# Altium schematic sheet OZ440-SE100-CAR003_sheet7.SchDoc
size A3
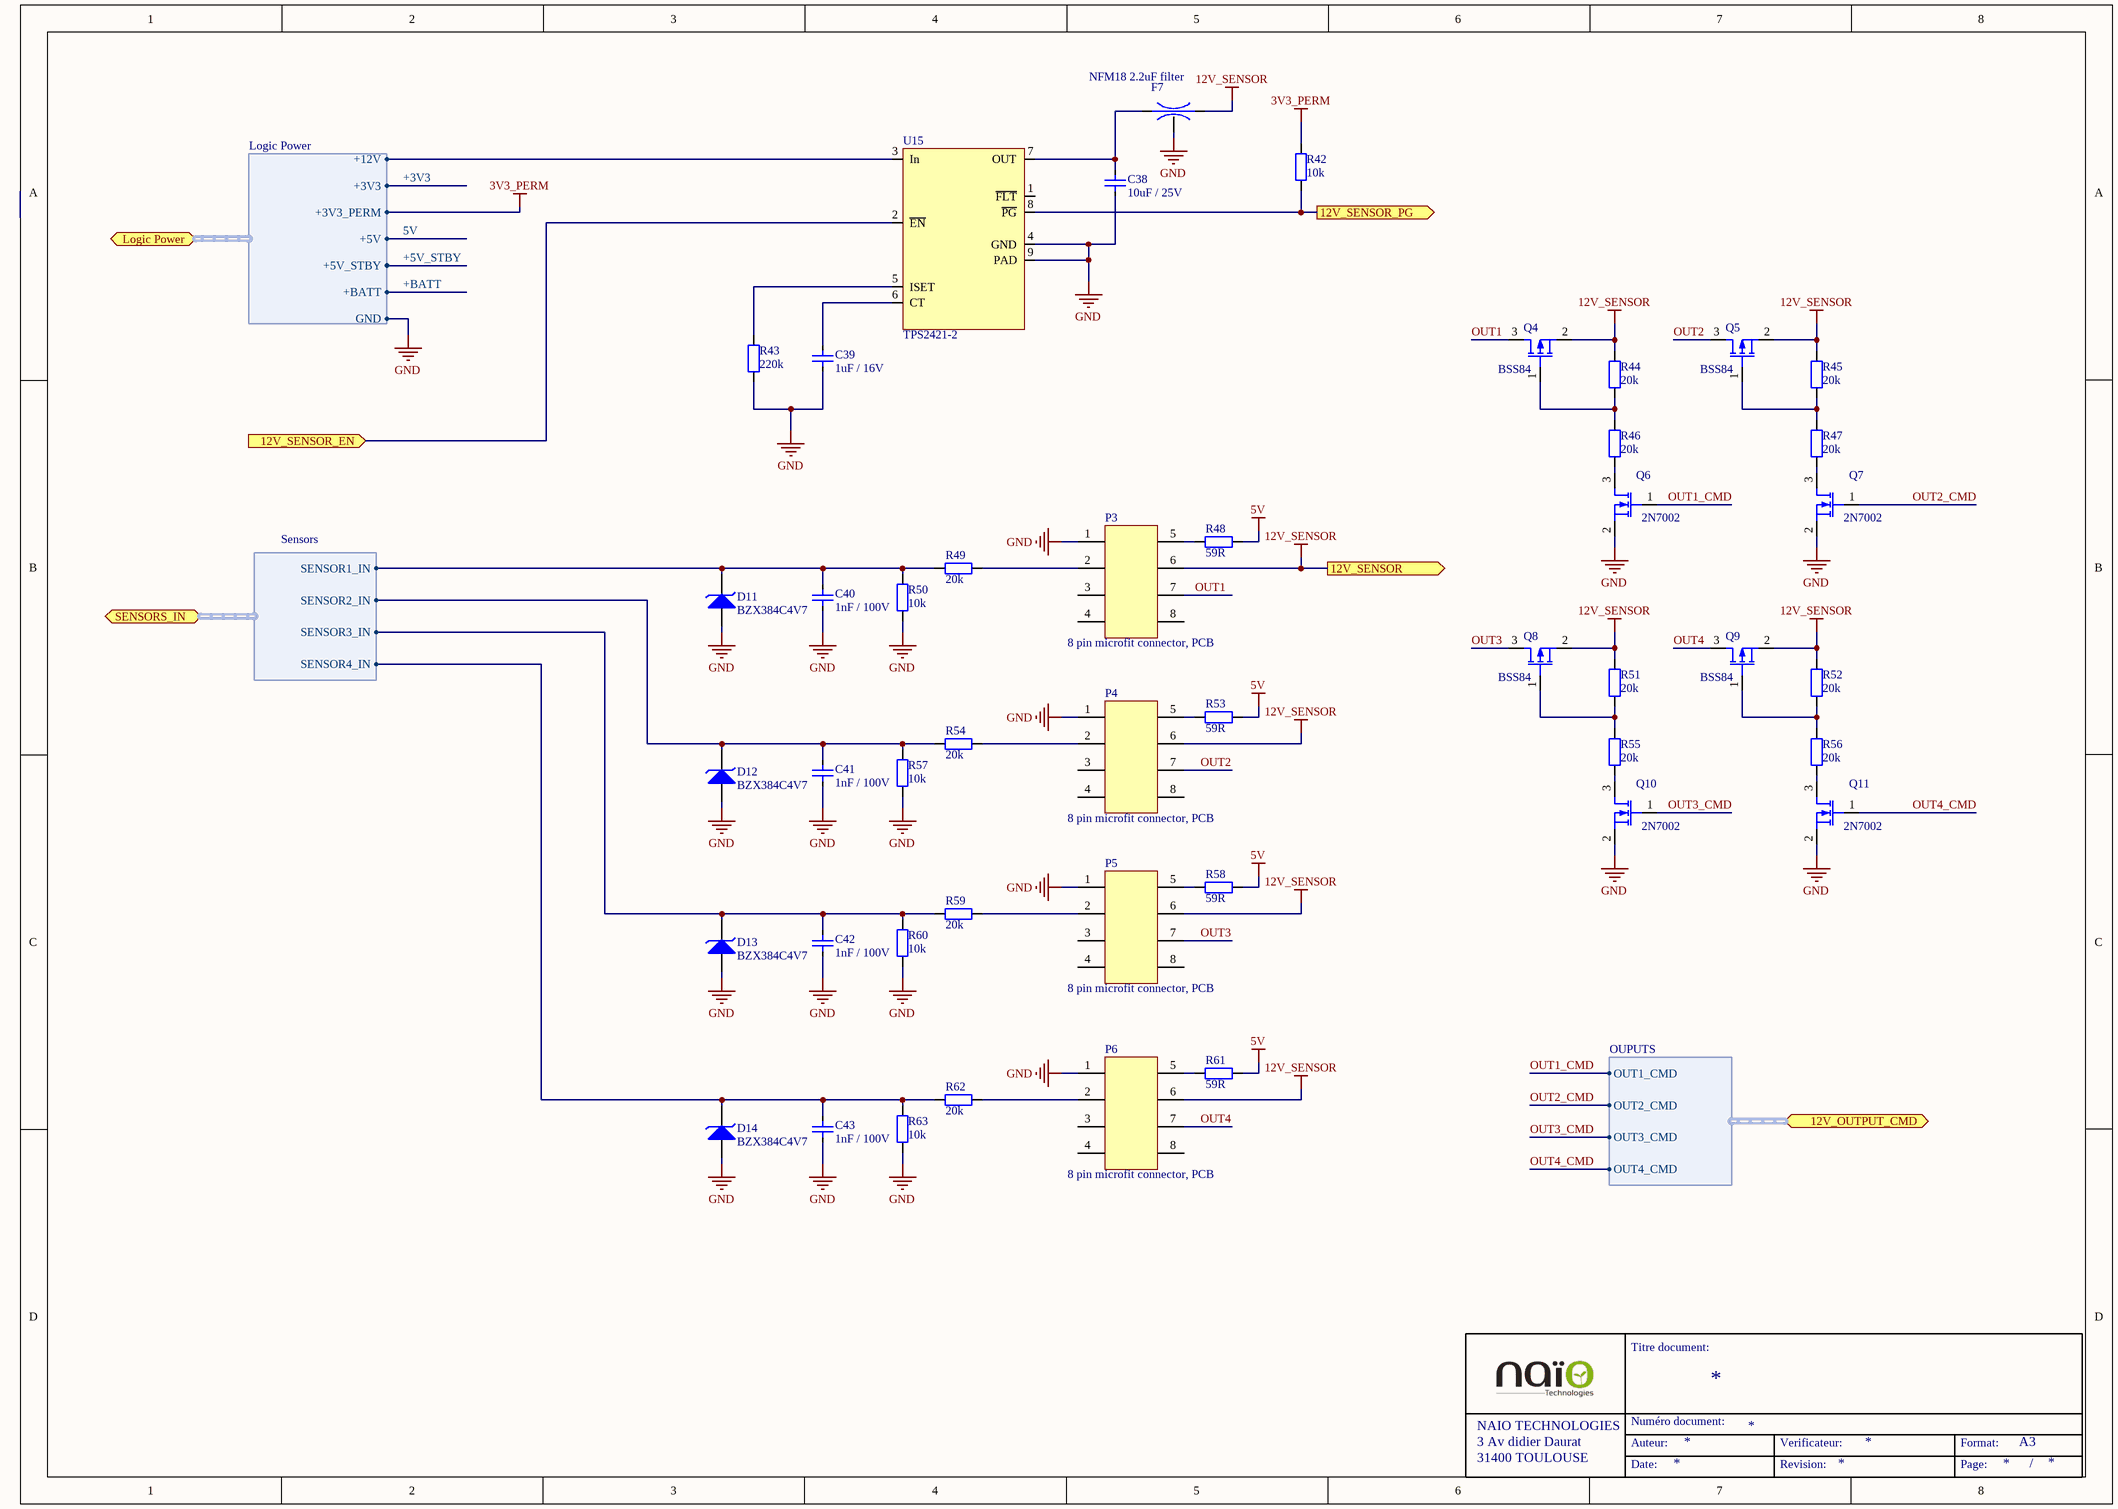
[diagram p0: OZ440-SE100-CAR003_sheet7.SchDoc]

## Parts
C38  Displayed reference: 10uF / 25V  [C1206-STD]  (hidden comment: CAP-SMD)
C39  Displayed reference: 1uF / 16V  [C0805-STD]  (hidden comment: CAP-SMD)
C40  Displayed reference: 1nF / 100V  [C0805-STD]  (hidden comment: CAP-SMD)
C41  Displayed reference: 1nF / 100V  [C0805-STD]  (hidden comment: CAP-SMD)
C42  Displayed reference: 1nF / 100V  [C0805-STD]  (hidden comment: CAP-SMD)
C43  Displayed reference: 1nF / 100V  [C0805-STD]  (hidden comment: CAP-SMD)
D11  Displayed reference: BZX384C4V7  [SOD323-SPE-BZX384]  (hidden comment: DIODE_ZENER-SOD323)
D12  Displayed reference: BZX384C4V7  [SOD323-SPE-BZX384]  (hidden comment: DIODE_ZENER-SOD323)
D13  Displayed reference: BZX384C4V7  [SOD323-SPE-BZX384]  (hidden comment: DIODE_ZENER-SOD323)
D14  Displayed reference: BZX384C4V7  [SOD323-SPE-BZX384]  (hidden comment: DIODE_ZENER-SOD323)
F7  Displayed reference: NFM18 2.2uF filter  [LC_0603-STD]  (hidden comment: LC_FILTER-STD)
P3  Displayed reference: 8 pin microfit connector, PCB  [CONN-SPE_MOLEX_43045-0801]  (hidden comment: CONN-SPE-8P_MOLEX_43045-0801)
P4  Displayed reference: 8 pin microfit connector, PCB  [CONN-SPE_MOLEX_43045-0801]  (hidden comment: CONN-SPE-8P_MOLEX_43045-0801)
P5  Displayed reference: 8 pin microfit connector, PCB  [CONN-SPE_MOLEX_43045-0801]  (hidden comment: CONN-SPE-8P_MOLEX_43045-0801)
P6  Displayed reference: 8 pin microfit connector, PCB  [CONN-SPE_MOLEX_43045-0801]  (hidden comment: CONN-SPE-8P_MOLEX_43045-0801)
Q4  Displayed reference: BSS84  [SOT23-STD]  (hidden comment: BSS84-SOT23)
Q5  Displayed reference: BSS84  [SOT23-STD]  (hidden comment: BSS84-SOT23)
Q6  Displayed reference: 2N7002  [SOT23-SPE-2N7002]  (hidden comment: 2N7002-SMD3P)
Q7  Displayed reference: 2N7002  [SOT23-SPE-2N7002]  (hidden comment: 2N7002-SMD3P)
Q8  Displayed reference: BSS84  [SOT23-STD]  (hidden comment: BSS84-SOT23)
Q9  Displayed reference: BSS84  [SOT23-STD]  (hidden comment: BSS84-SOT23)
Q10  Displayed reference: 2N7002  [SOT23-SPE-2N7002]  (hidden comment: 2N7002-SMD3P)
Q11  Displayed reference: 2N7002  [SOT23-SPE-2N7002]  (hidden comment: 2N7002-SMD3P)
R42  Displayed reference: 10k  [R0805-STD]  (hidden comment: RES-SMD)
R43  Displayed reference: 220k  [R0805-STD]  (hidden comment: RES-SMD)
R44  Displayed reference: 20k  [R0805-STD]  (hidden comment: RES-SMD)
R45  Displayed reference: 20k  [R0805-STD]  (hidden comment: RES-SMD)
R46  Displayed reference: 20k  [R0805-STD]  (hidden comment: RES-SMD)
R47  Displayed reference: 20k  [R0805-STD]  (hidden comment: RES-SMD)
R48  Displayed reference: 59R  [R0805-STD]  (hidden comment: RES-SMD)
R49  Displayed reference: 20k  [R0805-STD]  (hidden comment: RES-SMD)
R50  Displayed reference: 10k  [R0805-STD]  (hidden comment: RES-SMD)
R51  Displayed reference: 20k  [R0805-STD]  (hidden comment: RES-SMD)
R52  Displayed reference: 20k  [R0805-STD]  (hidden comment: RES-SMD)
R53  Displayed reference: 59R  [R0805-STD]  (hidden comment: RES-SMD)
R54  Displayed reference: 20k  [R0805-STD]  (hidden comment: RES-SMD)
R55  Displayed reference: 20k  [R0805-STD]  (hidden comment: RES-SMD)
R56  Displayed reference: 20k  [R0805-STD]  (hidden comment: RES-SMD)
R57  Displayed reference: 10k  [R0805-STD]  (hidden comment: RES-SMD)
R58  Displayed reference: 59R  [R0805-STD]  (hidden comment: RES-SMD)
R59  Displayed reference: 20k  [R0805-STD]  (hidden comment: RES-SMD)
R60  Displayed reference: 10k  [R0805-STD]  (hidden comment: RES-SMD)
R61  Displayed reference: 59R  [R0805-STD]  (hidden comment: RES-SMD)
R62  Displayed reference: 20k  [R0805-STD]  (hidden comment: RES-SMD)
R63  Displayed reference: 10k  [R0805-STD]  (hidden comment: RES-SMD)
U15  Displayed reference: TPS2421-2  [SO8_THERMAL-STD]  (hidden comment: TPS2421-SO8)

## Ports
12V_OUTPUT_CMD (harness OUPUTS), 12V_SENSOR (out), 12V_SENSOR_EN (in), 12V_SENSOR_PG (out), Logic Power (harness Logic Power), SENSORS_IN (harness Sensors)

## Harnesses
Logic Power: +12V, +3V3, +3V3_PERM, +5V, +5V_STBY, +BATT, GND
Sensors: SENSOR1_IN, SENSOR2_IN, SENSOR3_IN, SENSOR4_IN
OUPUTS: OUT4_CMD, OUT3_CMD, OUT2_CMD, OUT1_CMD

## Nets
3V3_PERM: R42.1 ; port Logic Power.+3V3_PERM
5V: R48.2 R53.2 R58.2 R61.2 ; port Logic Power.+5V
12V_SENSOR: F7.2(B) P3.6 P4.6 P5.6 P6.6 Q4.2(S) Q5.2(S) Q8.2(S) Q9.2(S) R44.2 R45.2 R51.2 R52.2 ; port 12V_SENSOR
GND: C38.1 C39.1 C40.1 C41.1 C42.1 C43.1 D11.A D12.A D13.A D14.A F7.3(G) P3.1 P4.1 P5.1 P6.1 Q6.2(S) Q7.2(S) Q10.2(S) Q11.2(S) R43.1 R50.1 R57.1 R60.1 R63.1 U15.4(GND) U15.9(PAD) ; port Logic Power.GND
12V_SENSOR_EN: U15.2(~{EN}) ; port 12V_SENSOR_EN
12V_SENSOR_PG: R42.2 U15.8(~{PG}) ; port 12V_SENSOR_PG
+3V3: port Logic Power.+3V3
+5V_STBY: port Logic Power.+5V_STBY
+BATT: port Logic Power.+BATT
OUT1: P3.7 Q4.3(D)
OUT1_CMD: Q6.1(G) ; port 12V_OUTPUT_CMD.OUT1_CMD
OUT2: P4.7 Q5.3(D)
OUT2_CMD: Q7.1(G) ; port 12V_OUTPUT_CMD.OUT2_CMD
OUT3: P5.7 Q8.3(D)
OUT3_CMD: Q10.1(G) ; port 12V_OUTPUT_CMD.OUT3_CMD
OUT4: P6.7 Q9.3(D)
OUT4_CMD: Q11.1(G) ; port 12V_OUTPUT_CMD.OUT4_CMD
NetC38_2: C38.2 F7.1(A) U15.7(OUT)
NetC39_2: C39.2 U15.6(CT)
NetC40_2: C40.2 D11.K R49.1 R50.2 ; port SENSORS_IN.SENSOR1_IN
NetC41_2: C41.2 D12.K R54.1 R57.2 ; port SENSORS_IN.SENSOR2_IN
NetC42_2: C42.2 D13.K R59.1 R60.2 ; port SENSORS_IN.SENSOR3_IN
NetC43_2: C43.2 D14.K R62.1 R63.2 ; port SENSORS_IN.SENSOR4_IN
NetP3_2: P3.2 R49.2
NetP3_5: P3.5 R48.1
NetP4_2: P4.2 R54.2
NetP4_5: P4.5 R53.1
NetP5_2: P5.2 R59.2
NetP5_5: P5.5 R58.1
NetP6_2: P6.2 R62.2
NetP6_5: P6.5 R61.1
NetQ4_1: Q4.1(G) R44.1 R46.2
NetQ5_1: Q5.1(G) R45.1 R47.2
NetQ6_3: Q6.3(D) R46.1
NetQ7_3: Q7.3(D) R47.1
NetQ8_1: Q8.1(G) R51.1 R55.2
NetQ9_1: Q9.1(G) R52.1 R56.2
NetQ10_3: Q10.3(D) R55.1
NetQ11_3: Q11.3(D) R56.1
NetR43_2: R43.2 U15.5(ISET)
NetU15_3: U15.3(In) ; port Logic Power.+12V

Not connected (* = marked no-connect by the designer): P3 3 4(7) 8; P4 3 4(7) 8; P5 3 4(7) 8; P6 3 4(7) 8; U15 1(~{FLT})

## Notes on the sheet
- Titre document:
- NAIO TECHNOLOGIES
- 3 Av didier Daurat
- 31400 TOULOUSE
- Auteur:
- Numéro document:
- Verificateur:
- Format:
- A3
- Date:
- Revision:
- Page:
- /

## Library data of the parts
C38 = C1206C106K3RACxx: 1206 10uF / 25V X7R ceramic capacitor; Manufacturer: Kemet; Max Voltage: 25; Tolerance: +/- 10%; Validated: N; Reference: C1206C106K3RACxx; Value: 10uF; Material: X7R; Footprint description: standard Capacitor 1206; Pin Count: 2; helpURL: http://www.farnell.com/datasheets/1444528.pdf; Supplier 1: Farnell; Supplier Part Number 1: 2118134; Supplier 2: Digi-Key; Supplier Part Number 2: 399-7442-1-ND
C39 = C0805C105K4RACxx: 0805 1uF / 16V X7R ceramic capacitor; Manufacturer: Kemet; Max Voltage: 16; Tolerance: +/- 10%; Validated: N; Reference: C0805C105K4RACxx; Value: 1uF; Material: X7R; Footprint description: standard Capacitor 0805; Pin Count: 2; helpURL: http://www.farnell.com/datasheets/40863.pdf; Supplier 1: Farnell; Supplier Part Number 1: 9227792; Supplier 2: Digi-Key; Supplier Part Number 2: 399-6930-1-ND
C40-C43 = VJ0805Y102KXBxx: 0805 1nF / 100V X7R ceramic capacitor; Manufacturer: vishay; Max Voltage: 50; Tolerance: +/- 10%; Validated: N; Reference: VJ0805Y102KXBxx; Value: 1nF; Material: X7R; Footprint description: standard Capacitor 0805; Pin Count: 2; helpURL: http://www.vishay.com/docs/45200/highrels.pdf; Supplier 1: Farnell; Supplier Part Number 1: 1555112; Supplier 2: Digi-Key; Supplier Part Number 2: 720-1264-1-ND
D11-D14 = BZX384C4V7: 4.7V zener diode; Manufacturer: VISHAY; Rated Power: 200mW; Validated: FALSE; Reference: BZX384C4V7; component type: Zener diode; Value: 4.7V; Footprint description: SOD323; Pin Count: 2; Rev: 1.9; helpURL: http://www.vishay.com/docs/85764/bzx384.pdf; Supplier 1: Mouser; Supplier Part Number 1: 771-BZX384-C4V7115; Supplier 2: Farnell; Supplier Part Number 2: 8735700
F7 = NFM18PC225B0J3: 2A LC filter; Manufacturer: MURATA; Max Voltage: 6.3; Frequency band: 0-20Mhz; Validated: False; Reference: NFM18PC225B0J3; Max Current: 2A; Footprint description: standard 0603 filter package; Pin Count: 3; Rev: 2/11/2011; helpURL: http://www.murata.com/products/emc/application/pdf/EMIAPDCE_2.pdf; Supplier 1: Digi-Key; Supplier Part Number 1: NFM18PC225B0J3D-ND; Supplier 2: Mouser; Supplier Part Number 2: 81-NFM18PC225B0J3D
P3-P6 = 43045-0801: 8 pin Microfit connector; Manufacturer: Molex; Max Voltage: 600V; Max Current: 5A; Validated: False; Reference: 43045-0801; Footprint description: 8 pin SMT connector RA, TH; Pin Count: 8; Rev: F; helpURL: http://www.molex.com/pdm_docs/sd/430450801_sd.pdf; Supplier 1: Mouser; Supplier Part Number 1: 538-43045-0801; Supplier 2: Digi-Key; Supplier Part Number 2: WM3253-ND
Q4 Q5 Q8 Q9 = BSS84: P-Channel Enhancement Mode Field Effect Transistor; Manufacturer: FAIRCHILD; Max Voltage: 50V; Max Current: 0,13A; Rated Power: 0,36W; Validated: False; Reference: BSS84; component type: PMOS; Footprint description: SOT23; Pin Count: 3; Rev: 1; helpURL: http://www.fairchildsemi.com/ds/BS/BSS84.pdf; Supplier 1: Mouser; Supplier Part Number 1: 512-BSS84; Supplier 2: Farnell; Supplier Part Number 2: 1094997
Q6 Q7 Q10 Q11 = 2N7002: N-Channel Enhancement Mode Field Effect Transistor; Manufacturer: FAIRCHILD; Max Voltage: 60 V; Max Current: 0,4 A; Rated Power: 0,2 W; Validated: False; Reference: 2N7002; component type: NMOS; Footprint description: SOT23; Pin Count: 3; Rev: A1; helpURL: http://www.fairchildsemi.com/ds/2N/2N7000.pdf; Supplier 1: Farnell; Supplier Part Number 1: 9845313; Supplier 2: Newark; Supplier Part Number 2: 58K9651
R42 R50 R57 R60 R63 = CRCW080510K0FKxx: 10k Ohm 0805 SMD resistor; Manufacturer: Vishay; Value: 10 000; Tolerance: 1 %; Rated Power: 0,125 W; Validated: No; Reference: CRCW080510K0FKxx; Footprint description: standard 0805 SMD; Pin Count: 2; helpURL: http://www.vishay.com/docs/20035/dcrcwe3.pdf; Supplier 1: Farnell; Supplier Part Number 1: 1469856; Supplier 2: Mouser; Supplier Part Number 2: 71-CRCW0805-10K-E3
R43 = CRCW0805220KFKxx: 220k Ohm 0805 SMD resistor; Manufacturer: Vishay; Value: 220 000; Tolerance: 1 %; Rated Power: 0,125 W; Validated: No; Reference: CRCW0805220KFKxx; Footprint description: standard 0805 SMD; Pin Count: 2; helpURL: http://www.vishay.com/docs/20035/dcrcwe3.pdf; Supplier 1: Farnell; Supplier Part Number 1: 1469653; Supplier 2: Mouser; Supplier Part Number 2: 71-CRCW0805220KFKEA
R44-R47 R49 R51 R52 R54-R56 R59 R62 = CRCW080520K0FKxx: 20k Ohm 0805 SMD resistor; Manufacturer: Vishay; Value: 20 000; Tolerance: 1 %; Rated Power: 0,125 W; Validated: No; Reference: CRCW080520K0FKxx; Footprint description: standard 0805 SMD; Pin Count: 2; helpURL: http://www.vishay.com/docs/20035/dcrcwe3.pdf; Supplier 1: Farnell; Supplier Part Number 1: 1469893; Supplier 2: Mouser; Supplier Part Number 2: 71-CRCW0805-20K-E3
R48 R53 R58 R61 = CRCW080559R0FKxx: 59 Ohm 0805 SMD resistor; Manufacturer: Vishay; Value: 59; Tolerance: 1 %; Rated Power: 0.125 W; Validated: No; Reference: CRCW080559R0FKxx; Footprint description: standard 0805 SMD; Pin Count: 2; helpURL: http://www.vishay.com/docs/20035/dcrcwe3.pdf; Supplier 1: Mouser; Supplier Part Number 1: 71-CRCW080559R0FKEA; Supplier 2: Farnell; Supplier Part Number 2: 2138817
U15 = TPS2421-2DDA: 20V-5A Hot plug controller with integrated FET, auto retry; Manufacturer: TI; Max Voltage: 20V; Max Current: 5A; Validated: False; Reference: TPS2421-2DDA; Footprint description: SO8 with thermal PAD; Pin Count: 8; Rev: 01/14; helpURL: http://www.ti.com/lit/ds/symlink/tps2421-1.pdf; Supplier 1: Mouser; Supplier Part Number 1: 595-TPS2421-2DDA; Supplier 2: Farnell; Supplier Part Number 2: 2323674